# Altium schematic sheet Sheet1.SchDoc (part 3 of 3)
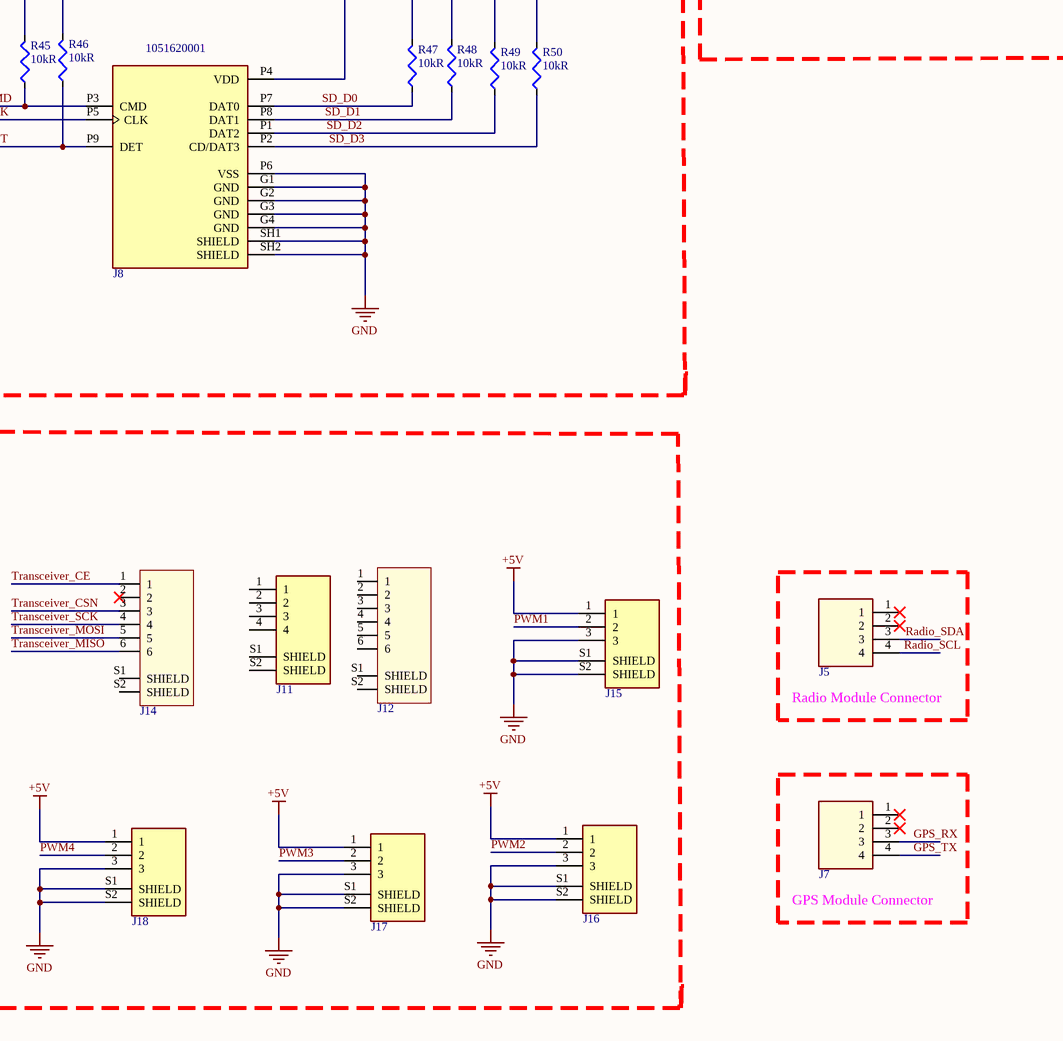
[diagram p5: Sheet1.SchDoc, bottom right]

## Library data of the parts (continued)
R14 R15 = ERJ-2RKF4701X: Res Thick Film 0402 4.7K Ohm 1% 1/10W ±100ppm/°C Molded SMD Punched Carrier T/R; Manufacturer: Panasonic; Power Rating: 100mW; Voltage Rating: 50V; Supplier: Rs; Supplier Part Number: 7325517; Manufacturer Part Number: ERJ-2RKF4701X; RoHS: Yes; Category: Chip SMD Resistors; Stock: 290000; Pricing: 10000=0.00400 (GBP); Mounting Technology: Surface Mount; Case/Package: 0402; Pins: 2; Contact Plating: Tin; Case Code (Metric): 1005; Case Code (Imperial): 0402; Weight: 0.000388oz; Min Operating Temperature: -55°C; Max Operating Temperature: 155°C; Tolerance: 1%; Resistor Type: Thick Film; Temperature Coefficient: 100ppm/°C; Packaging: Cut Tape; Package Quantity: 10000; Number of Terminations: 2; Termination: SMD/SMT; Max Power Dissipation: 100mW; Voltage Rating (DC): 50V; Features: Automotive AEC-Q200; Series: ERJ-2Rx; Technology: THICK FILM; Length: 1mm; Width: 0.5mm; Height: 0.35mm; Depth: 0.5mm; Radiation Hardening: No; Lead Free: Lead Free; Reach SVHC Compliant: Yes; Military Standard: Not; RoHS Compliant: Yes; ComponentLink1URL: https://datasheet.ciiva.com/11821/0900766b80f80784-11821329.pdf?src-supplier=Rs; ComponentLink1Description: https://datasheet.ciiva.com/11821/0900766b80f80784-11821329.pdf?src-supplier=Rs; ComponentLink2URL: https://datasheet.ciiva.com/7830/aoa0000ce2-7830727.pdf?src-supplier=Element14; ComponentLink2Description: https://datasheet.ciiva.com/7830/aoa0000ce2-7830727.pdf?src-supplier=Element14; ComponentLink3URL: https://datasheet.ciiva.com/22781/1678782-22781576.pdf?src-supplier=Farnell; ComponentLink3Description: https://datasheet.ciiva.com/22781/1678782-22781576.pdf?src-supplier=Farnell; ComponentLink4URL: https://datasheet.ciiva.com/22667/1678782-22667886.pdf?src-supplier=Element14; ComponentLink4Description: https://datasheet.ciiva.com/22667/1678782-22667886.pdf?src-supplier=Element14; ComponentLink5URL: https://datasheet.ciiva.com/22723/1678782-22723903.pdf?src-supplier=Element14; ComponentLink5Description: https://datasheet.ciiva.com/22723/1678782-22723903.pdf?src-supplier=Element14; ComponentLink6URL: https://datasheet.ciiva.com/24025/aoa0000ce2-24025663.pdf?src-supplier=Mouser; ComponentLink6Description: https://datasheet.ciiva.com/24025/aoa0000ce2-24025663.pdf?src-supplier=Mouser; ComponentLink7URL: https://datasheet.ciiva.com/16763/70260748-16763151.pdf?src-supplier=Allied+Electronics; ComponentLink7Description: https://datasheet.ciiva.com/16763/70260748-16763151.pdf?src-supplier=Allied+Electronics; ComponentLink8URL: https://datasheet.ciiva.com/9195/aoa0000ce2-9195737.pdf?src-supplier=Avnet; ComponentLink8Description: https://datasheet.ciiva.com/9195/aoa0000ce2-9195737.pdf?src-supplier=Avnet; ComponentLink9URL: https://datasheet.ciiva.com/30053/aoa0000ce2-30053990.pdf?src-supplier=Onlinecomponents.com; ComponentLink9Description: https://datasheet.ciiva.com/30053/aoa0000ce2-30053990.pdf?src-supplier=Onlinecomponents.com
R18 R19 = ERJ-2GE0R00X: SMD Chip Resistor, Jumper, 0 ohm, 100 mW, 0402 [1005 Metric], Thick Film, General Purpose; Manufacturer: Panasonic; Power Rating: 100mW; Voltage Rating: 50V; Tolerance: 5%; Temperature Coefficient: 600ppm/°C; Supplier: Digi-Key; Supplier Part Number: P0.0JCT-ND; Manufacturer Part Number: ERJ-2GE0R00X; RoHS: Yes; Category: Chip SMD Resistors; Stock: 12419974; Pricing: 1=0.10000, 10=0.02700, 25=0.02000, 50=0.01500, 100=0.01110, 250=0.00848, 500=0.00680, 1000=0.00500, 5000=0.00359 (USD); Mounting Technology: Surface Mount; Case/Package: 0402; Contact Plating: Tin; Case Code (Metric): 1005; Case Code (Imperial): 0402; Min Operating Temperature: -55°C; Max Operating Temperature: 155°C; Resistor Type: Thick Film; Packaging: Cut Tape; Package Quantity: 10000; Number of Terminations: 2; Termination: SMD/SMT; Max Power Dissipation: 100mW; Voltage Rating (DC): 50V; Features: Automotive AEC-Q200; Series: ERJ; Construction: Rectangular; Technology: THICK FILM; Length: 1mm; Width: 0.5mm; Height: 0.35mm; Depth: 0.5mm; Ratings: AEC-Q200; Radiation Hardening: No; Reach SVHC Compliant: Yes; Military Standard: Not; Lead Free: Lead Free; RoHS Compliant: Yes; ComponentLink1URL: https://datasheet.ciiva.com/11821/0900766b80f806dd-11821176.pdf?src-supplier=Rs; ComponentLink1Description: https://datasheet.ciiva.com/11821/0900766b80f806dd-11821176.pdf?src-supplier=Rs; ComponentLink2URL: https://datasheet.ciiva.com/43460/1678796-43460347.pdf?src-supplier=Farnell; ComponentLink2Description: https://datasheet.ciiva.com/43460/1678796-43460347.pdf?src-supplier=Farnell; ComponentLink3URL: https://datasheet.ciiva.com/46389/1678796-46389518.pdf?src-supplier=Element14; ComponentLink3Description: https://datasheet.ciiva.com/46389/1678796-46389518.pdf?src-supplier=Element14; ComponentLink4URL: https://datasheet.ciiva.com/5959/1678796-5959692.pdf?src-supplier=Farnell; ComponentLink4Description: https://datasheet.ciiva.com/5959/1678796-5959692.pdf?src-supplier=Farnell; ComponentLink5URL: https://datasheet.ciiva.com/28695/1678796-28695758.pdf?src-supplier=Element14; ComponentLink5Description: https://datasheet.ciiva.com/28695/1678796-28695758.pdf?src-supplier=Element14; ComponentLink6URL: https://datasheet.ciiva.com/16783/70260739-16783734.pdf?src-supplier=Allied+Electronics; ComponentLink6Description: https://datasheet.ciiva.com/16783/70260739-16783734.pdf?src-supplier=Allied+Electronics; ComponentLink7URL: https://datasheet.ciiva.com/16778/70260739-16778335.pdf?src-supplier=Allied+Electronics; ComponentLink7Description: https://datasheet.ciiva.com/16778/70260739-16778335.pdf?src-supplier=Allied+Electronics; ComponentLink8URL: https://datasheet.ciiva.com/48531/aoa0000ce1-48531077.pdf?src-supplier=Avnet; ComponentLink8Description: https://datasheet.ciiva.com/48531/aoa0000ce1-48531077.pdf?src-supplier=Avnet; ComponentLink9URL: https://datasheet.ciiva.com/30097/4aoa0000ce1-30097116.pdf?src-supplier=Onlinecomponents.com; ComponentLink9Description: https://datasheet.ciiva.com/30097/4aoa0000ce1-30097116.pdf?src-supplier=Onlinecomponents.com
R20-R22 = ERA2AEB5112X: 51.1 kOhms ±0.1% 0.063W, 1/16W Chip Resistor 0402 (1005 Metric) Automotive AEC-Q200 Thin Film; Manufacturer Part Number: ERA2AEB5112X
R23 R24 R28 = RT0402BRD07220KL: High Precision-High Stability Chip Resistor Thin Film 0402 220kOhm 0.1% Paper T/R; Manufacturer: Yageo; Supplier: Arrow Electronics; Supplier Part Number: RT0402BRD07220KL; Manufacturer Part Number: RT0402BRD07220KL; RoHS: Yes; Category: Chip SMD Resistors; Stock: 310000; Pricing: 10000=0.047, 20000=0.0452, 30000=0.0442, 50000=0.0425, 100000=0.0416 (USD); Case/Package: 0402
R25-R27 = ERJ-2RKF3401X: Res Thick Film 0402 3.4K Ohm 1% 1/10W ±100ppm/°C Molded SMD Punched Carrier T/R; Manufacturer: Panasonic; Voltage Rating (DC): 50V; Supplier: Mouser; Supplier Part Number: 667-ERJ-2RKF3401X; Manufacturer Part Number: ERJ-2RKF3401X; RoHS: Yes; Category: Chip SMD Resistors; Stock: 133092; Pricing: 1=0.1, 10=0.023, 50=0.023, 100=0.013, 1000=0.008, 10000=0.004 (USD); Lead Free: 5698LeadFree; ComponentLink1URL: https://datasheet.ciiva.com/6201/426256-6201358.pdf?src-supplier=Farnell; ComponentLink1Description: https://datasheet.ciiva.com/6201/426256-6201358.pdf?src-supplier=Farnell; ComponentLink2URL: https://datasheet.ciiva.com/9196/aoa0000ce2-9196415.pdf?src-supplier=Avnet; ComponentLink2Description: https://datasheet.ciiva.com/9196/aoa0000ce2-9196415.pdf?src-supplier=Avnet; ComponentLink3URL: https://datasheet.ciiva.com/24160/aoa0000ce2-24160133.pdf?src-supplier=Mouser; ComponentLink3Description: https://datasheet.ciiva.com/24160/aoa0000ce2-24160133.pdf?src-supplier=Mouser; ComponentLink4URL: https://datasheet.ciiva.com/30115/aoa0000ce2-30115213.pdf?src-supplier=Onlinecomponents.com; ComponentLink4Description: https://datasheet.ciiva.com/30115/aoa0000ce2-30115213.pdf?src-supplier=Onlinecomponents.com; ComponentLink5URL: https://datasheet.ciiva.com/16771/70260748-16771656.pdf?src-supplier=Allied+Electronics; ComponentLink5Description: https://datasheet.ciiva.com/16771/70260748-16771656.pdf?src-supplier=Allied+Electronics; ComponentLink6URL: https://datasheet.ciiva.com/16774/70260748-16774598.pdf?src-supplier=Allied+Electronics; ComponentLink6Description: https://datasheet.ciiva.com/16774/70260748-16774598.pdf?src-supplier=Allied+Electronics; ComponentLink7URL: https://datasheet.ciiva.com/46389/426256-46389135.pdf?src-supplier=Element14; ComponentLink7Description: https://datasheet.ciiva.com/46389/426256-46389135.pdf?src-supplier=Element14; Case/Package: 0402
R29-R31 = RT0402BRD07140KL: SMD Chip Resistor, 140 kOhm, ± 0.1%, 63 mW, 0402 [1005 Metric], Thin Film, High Precision High Stability; Manufacturer: Yageo; Temperature Coefficient: 25ppm/°C; Supplier: Farnell; Supplier Part Number: 4312055; Manufacturer Part Number: RT0402BRD07140KL; RoHS: Yes; Category: Chip SMD Resistors; Stock: 9900; Pricing: 10=0.121, 100=0.105, 500=0.066, 2500=0.057, 5000=0.048, 10000=0.047, 50000=0.0461, 100000=0.0451 (EUR); Case/Package: 0402; Packaging: 10Packaging; ComponentLink1URL: https://datasheet.octopart.com/RT0402BRD07140KL-Yageo-datasheet-166250672.pdf?src-supplier=Future+Electronics; ComponentLink1Description: https://datasheet.octopart.com/RT0402BRD07140KL-Yageo-datasheet-166250672.pdf?src-supplier=Future+Electronics; ComponentLink2URL: https://datasheet.octopart.com/RT0402BRD07140KL-Yageo-datasheet-164439670.pdf?src-supplier=Newark; ComponentLink2Description: https://datasheet.octopart.com/RT0402BRD07140KL-Yageo-datasheet-164439670.pdf?src-supplier=Newark
R32 R33 R36 = ERA-2APB433X: 0402 Thin Film Chip Resistor / 0402 SMD Resistor 0.1% 15PPM 43 Kohm; Manufacturer: Panasonic; Max Power Dissipation: 63mW; Temperature Coefficient: 15ppm/°C; Supplier: Mouser; Supplier Part Number: 667-ERA-2APB433X; Manufacturer Part Number: ERA-2APB433X; RoHS: Yes; Category: Chip SMD Resistors; Stock: 8335; Pricing: 1=0.73, 10=0.471, 50=0.471, 100=0.41, 1000=0.24, 10000=0.218 (USD); Case/Package: 0402; Case Code (Metric): 1005; Case Code (Imperial): 0402; Min Operating Temperature: -55°C; Max Operating Temperature: 155°C; Packaging: Cut Tape; Number of Terminations: 2; Features: Automotive AEC-Q200; Series: ERA-2A; Length: 0.039inch; Width: 0.02inch; Height: 0.016inch; Lead Free: Lead Free; ComponentLink1URL: https://media.digikey.com/pdf/Data%20Sheets/Panasonic%20Resistors%20Thermistors%20PDFs/ERA_Series_LE.pdf?src-supplier=Digi-Key; ComponentLink1Description: https://media.digikey.com/pdf/Data%20Sheets/Panasonic%20Resistors%20Thermistors%20PDFs/ERA_Series_LE.pdf?src-supplier=Digi-Key
R34 R35 R37 = ERA-2AEB104X: Res Thin Film 0402 100K Ohm 0.1% 0.063W ±25ppm/°C Molded SMD Punched Carrier T/R; Manufacturer: Panasonic; Voltage Rating (DC): 25V; Supplier: Mouser; Supplier Part Number: 667-ERA-2AEB104X; Manufacturer Part Number: ERA-2AEB104X; RoHS: Yes; Category: Chip SMD Resistors; Stock: 96467; Pricing: 1=0.17, 10=0.102, 50=0.102, 100=0.091, 1000=0.061, 10000=0.051 (USD); Lead Free: 5697LeadFree; ComponentLink1URL: https://datasheet.ciiva.com/11812/0900766b80beefcc-11812257.pdf?src-supplier=Rs; ComponentLink1Description: https://datasheet.ciiva.com/11812/0900766b80beefcc-11812257.pdf?src-supplier=Rs; ComponentLink2URL: https://datasheet.ciiva.com/16787/70068849-16787783.pdf?src-supplier=Allied+Electronics; ComponentLink2Description: https://datasheet.ciiva.com/16787/70068849-16787783.pdf?src-supplier=Allied+Electronics; ComponentLink3URL: https://datasheet.ciiva.com/46398/328837-46398997.pdf?src-supplier=Element14; ComponentLink3Description: https://datasheet.ciiva.com/46398/328837-46398997.pdf?src-supplier=Element14; ComponentLink4URL: https://datasheet.ciiva.com/16396/aoa0000ce26-16396826.pdf?src-supplier=Future+Electronics; ComponentLink4Description: https://datasheet.ciiva.com/16396/aoa0000ce26-16396826.pdf?src-supplier=Future+Electronics; ComponentLink5URL: https://datasheet.ciiva.com/9186/aoa0000ce26-9186748.pdf?src-supplier=Avnet; ComponentLink5Description: https://datasheet.ciiva.com/9186/aoa0000ce26-9186748.pdf?src-supplier=Avnet; ComponentLink6URL: https://datasheet.ciiva.com/9116/aoa0000ce26-9116650.pdf?src-supplier=Avnet; ComponentLink6Description: https://datasheet.ciiva.com/9116/aoa0000ce26-9116650.pdf?src-supplier=Avnet; ComponentLink7URL: https://datasheet.ciiva.com/5838/328837-5838014.pdf?src-supplier=Farnell; ComponentLink7Description: https://datasheet.ciiva.com/5838/328837-5838014.pdf?src-supplier=Farnell; Case/Package: 0402
R38 = RC0402FR-0778K7L: Res Thick Film 0402 78.7K Ohm 1% 1/16W ±100ppm/°C Molded SMD Paper T/R; Manufacturer: Yageo; Power Rating: 62.5mW; Voltage Rating: 50V; Max Power Dissipation: 63mW; Supplier: Future Electronics; Supplier Part Number: 7141302; Manufacturer Part Number: RC0402FR-0778K7L; RoHS: Yes; Category: Chip SMD Resistors; Stock: 430000; Pricing: 10000=0.0015, 50000=0.0015, 250000=0.0014, 500000=0.0013, 1500000=0.0012 (USD); Case/Package: 0402; Contact Plating: Tin,Matte; Case Code (Metric): 1005; Case Code (Imperial): 0402; Weight: 2.3E-05oz; Min Operating Temperature: -55°C; Max Operating Temperature: 155°C; Tolerance: 1%; Temperature Coefficient: 100ppm/°C; Package Quantity: 1; Packaging: Tape and Reel; Number of Terminations: 2; Termination: SMD/SMT; Features: Moisture Resistant; Series: RC; Construction: Rectangular; Voltage Rating (DC): 50V; Length: 1mm; Width: 0.02inch; Height: 0.016inch; Depth: 0.5mm; Military Standard: Not; RoHS Compliant: Yes; Lead Free: 5697LeadFree; ComponentLink1URL: https://datasheet.ciiva.com/2491/pyu-r-int-thick-7-2491262.pdf?src-supplier=Digikey; ComponentLink1Description: https://datasheet.ciiva.com/2491/pyu-r-int-thick-7-2491262.pdf?src-supplier=Digikey; ComponentLink2URL: https://datasheet.ciiva.com/2491/pyu-r-int-thick-7-2491263.pdf?src-supplier=Digikey; ComponentLink2Description: https://datasheet.ciiva.com/2491/pyu-r-int-thick-7-2491263.pdf?src-supplier=Digikey; ComponentLink3URL: https://datasheet.ciiva.com/2491/pyu-r-int-thick-7-2491261.pdf?src-supplier=Digikey; ComponentLink3Description: https://datasheet.ciiva.com/2491/pyu-r-int-thick-7-2491261.pdf?src-supplier=Digikey; ComponentLink4URL: https://datasheet.ciiva.com/5596/pyu-rc0402-51-rohs-l-6-r-5596046.pdf?src-supplier=Mouser; ComponentLink4Description: https://datasheet.ciiva.com/5596/pyu-rc0402-51-rohs-l-6-r-5596046.pdf?src-supplier=Mouser; ComponentLink5URL: https://datasheet.ciiva.com/8888/pyu-rc0402-51-rohs-l-6-8888223.pdf?src-supplier=Avnet; ComponentLink5Description: https://datasheet.ciiva.com/8888/pyu-rc0402-51-rohs-l-6-8888223.pdf?src-supplier=Avnet; ComponentLink6URL: https://datasheet.ciiva.com/17423/pyu-rc0402-51-rohs-l-6-r-17423799.pdf?src-supplier=Future+Electronics; ComponentLink6Description: https://datasheet.ciiva.com/17423/pyu-rc0402-51-rohs-l-6-r-17423799.pdf?src-supplier=Future+Electronics
R39 = TNPW040232K0BEED: SMD Chip Resistor, 32 kOhm, ± 0.1%, 100 mW, 0402 [1005 Metric], Thin Film, High Stability; Manufacturer: Vishay Dale; Supplier: Mouser; Supplier Part Number: 71-TNPW040232K0BEED; Manufacturer Part Number: TNPW040232K0BEED; RoHS: Yes; Category: Chip SMD Resistors; Stock: 21931; Pricing: 1=0.35, 10=0.243, 50=0.193, 100=0.171, 1000=0.114, 10000=0.1 (USD); ComponentLink1URL: https://datasheet.ciiva.com/9017/tnpw-e3-9017983.pdf?src-supplier=Avnet; ComponentLink1Description: https://datasheet.ciiva.com/9017/tnpw-e3-9017983.pdf?src-supplier=Avnet; Case/Package: 0402
R40 = ERA3AEB1912V: 100mW Thin Film Resistor 75V ±0.1% ±25ppm/℃ 19.1kΩ 0603 Chip Resistor - Surface Mount ROHS; Manufacturer Part Number: ERA3AEB1912V
R42 = RMCF0201ZT0R00: Res Thick Film 0201 0 Ohm Jumper Molded SMD Paper T/R; Manufacturer: Stackpole Electronics; Voltage Rating: 25V; Supplier: Mouser; Supplier Part Number: 708-RMCF0201ZT0R00; Manufacturer Part Number: RMCF0201ZT0R00; RoHS: Yes; Category: Chip SMD Resistors; Stock: 435831; Pricing: 1=0.1, 10=0.01, 50=0.01, 100=0.006, 1000=0.004, 10000=0.002 (USD); Lead Free: 5697LeadFree; ComponentLink1URL: http://www.seielect.com/Catalog/SEI-RMC.pdf?src-supplier=Future+Electronics; ComponentLink1Description: http://www.seielect.com/Catalog/SEI-RMC.pdf?src-supplier=Future+Electronics; ComponentLink2URL: https://datasheet.octopart.com/RMCF0201ZT0R00-Stackpole-Electronics-datasheet-11547379.pdf?src-supplier=Future+Electronics; ComponentLink2Description: https://datasheet.octopart.com/RMCF0201ZT0R00-Stackpole-Electronics-datasheet-11547379.pdf?src-supplier=Future+Electronics; ComponentLink3URL: https://www.seielect.com/catalog/SEI-Packaging.pdf?src-supplier=Digikey; ComponentLink3Description: https://www.seielect.com/catalog/SEI-Packaging.pdf?src-supplier=Digikey; ComponentLink4URL: https://www.seielect.com/catalog/SEI-RMCF_RMCP.pdf?src-supplier=Avnet; ComponentLink4Description: https://www.seielect.com/catalog/SEI-RMCF_RMCP.pdf?src-supplier=Avnet; ComponentLink5URL: https://datasheet.octopart.com/RMCF0201ZT0R00-Stackpole-Electronics-datasheet-155966809.pdf?src-supplier=Master+Electronics; ComponentLink5Description: https://datasheet.octopart.com/RMCF0201ZT0R00-Stackpole-Electronics-datasheet-155966809.pdf?src-supplier=Master+Electronics; Case/Package: 0201
R51 = ERJ-2RKF10R0X: Res Thick Film 0402 10 Ohm 1% 1/10W ±100ppm/°C Molded SMD Punched Carrier T/R; Manufacturer: Panasonic; Power Rating: 100mW; Voltage Rating: 50V; Supplier: Mouser; Supplier Part Number: 667-ERJ-2RKF10R0X; Manufacturer Part Number: ERJ-2RKF10R0X; RoHS: Yes; Category: Chip SMD Resistors; Stock: 1740684; Pricing: 1=0.1, 10=0.017, 50=0.017, 100=0.008, 1000=0.006, 10000=0.004 (USD); Case Code (Imperial): 0402; Case Code (Metric): 1005; Weight: 0.000388oz; Min Operating Temperature: -55°C; Max Operating Temperature: 155°C; Tolerance: 1%; Packaging: Cut Tape; Package Quantity: 10000; Termination: SMD/SMT; Temperature Coefficient: 100ppm/°C; Voltage Rating (DC): 50V; Series: ERJ-2Rx; Technology: THICK FILM; Length: 1mm; Width: 0.5mm; Height: 0.35mm; Lead Free: Lead Free; RoHS Compliant: Yes; ComponentLink1URL: https://datasheet.ciiva.com/11821/0900766b80f80784-11821168.pdf?src-supplier=Rs; ComponentLink1Description: https://datasheet.ciiva.com/11821/0900766b80f80784-11821168.pdf?src-supplier=Rs; ComponentLink2URL: https://datasheet.ciiva.com/6082/aoa0000ce2-6082046.pdf?src-supplier=Farnell; ComponentLink2Description: https://datasheet.ciiva.com/6082/aoa0000ce2-6082046.pdf?src-supplier=Farnell; ComponentLink3URL: https://datasheet.ciiva.com/43467/1678782-43467127.pdf?src-supplier=Farnell; ComponentLink3Description: https://datasheet.ciiva.com/43467/1678782-43467127.pdf?src-supplier=Farnell; ComponentLink4URL: https://datasheet.ciiva.com/7802/aoa0000ce2-7802405.pdf?src-supplier=Element14; ComponentLink4Description: https://datasheet.ciiva.com/7802/aoa0000ce2-7802405.pdf?src-supplier=Element14; ComponentLink5URL: https://datasheet.ciiva.com/27055/1987054-27055644.pdf?src-supplier=Jameco; ComponentLink5Description: https://datasheet.ciiva.com/27055/1987054-27055644.pdf?src-supplier=Jameco; ComponentLink6URL: https://datasheet.ciiva.com/22668/1678782-22668302.pdf?src-supplier=Element14; ComponentLink6Description: https://datasheet.ciiva.com/22668/1678782-22668302.pdf?src-supplier=Element14; ComponentLink7URL: https://datasheet.ciiva.com/24071/aoa0000ce2-24071514.pdf?src-supplier=Mouser; ComponentLink7Description: https://datasheet.ciiva.com/24071/aoa0000ce2-24071514.pdf?src-supplier=Mouser; ComponentLink8URL: https://datasheet.ciiva.com/16773/70260748-16773366.pdf?src-supplier=Allied+Electronics; ComponentLink8Description: https://datasheet.ciiva.com/16773/70260748-16773366.pdf?src-supplier=Allied+Electronics; ComponentLink9URL: https://datasheet.ciiva.com/9194/aoa0000ce2-9194120.pdf?src-supplier=Avnet; ComponentLink9Description: https://datasheet.ciiva.com/9194/aoa0000ce2-9194120.pdf?src-supplier=Avnet; ComponentLink10URL: https://datasheet.ciiva.com/30218/aoa0000ce2-30218536.pdf?src-supplier=Onlinecomponents.com; ComponentLink10Description: https://datasheet.ciiva.com/30218/aoa0000ce2-30218536.pdf?src-supplier=Onlinecomponents.com; Case/Package: 0402
SW1 = 1825232-1: Switch Slide ON None ON SPDT Side Slide 0.2A 30VDC 10000Cycle PC Pins Bracket Mount/Through Hole; Manufacturer: TE Connectivity AMP; Mechanical Life: 10000Cycles; Actuator Material: Nylon; Voltage Rating (DC): 30V; Current Rating: 200mA; Operating Force: 200gf; Contact Style: Non-Shorting; Switch Travel: 2mm; Number of Positions: 2; PCB Mount Retention: With; Switch Function: On-On; Actuator Type: Standard; Actuator Length: 0.118inch; Tail Length: 0.094inch; Supplier: Avnet; Supplier Part Number: 97X7939; Manufacturer Part Number: 1825232-1; RoHS: Yes; Category: Slide Switches; Stock: 7369; Pricing: 1=0.45000, 10=0.43100, 25=0.40900, 100=0.37200, 500=0.32000, 1000=0.26700 (USD); Mounting Technology: Through Hole; Contact Material: Copper Alloy; Contact Plating: Silver; Min Operating Temperature: -20°C; Max Operating Temperature: 70°C; Throw Configuration: SPDT; Package Quantity: 19200; Packaging: Tray; Max Voltage Rating (DC): 30V; Termination: PC Pin; Electrical Life: 10000Cycles; Orientation: Right Angle; Contact Current Rating: 200mA; Type: Switch; Length: 0.3563inch; Width: 4.3mm; ELV: Compliant; Flammability Rating: UL94 HB; RoHS Compliant: Yes; ComponentLink1URL: https://datasheet.ciiva.com/15085/eng-cd-1825232-b2-15085854.pdf?src-supplier=Digi-Key; ComponentLink1Description: https://datasheet.ciiva.com/15085/eng-cd-1825232-b2-15085854.pdf?src-supplier=Digi-Key
U1-U3 = TPS54335ADDA: 4.5V to 28V Input, 3A, Synchronous, Step-Down Converter with Eco-mode; Manufacturer Part Number: TPS54335ADDA; ComponentLink1URL: https://datasheet.ciiva.com/48512/tps54361-q1-48512600.pdf?src-supplier=Avnet; ComponentLink1Description: https://datasheet.ciiva.com/48512/tps54361-q1-48512600.pdf?src-supplier=Avnet
U4 = ICM-20948: Accelerometer, Gyroscope, Magnetometer, 9 Axis Sensor I2C, SPI Output; Manufacturer Part Number: ICM-20948
U6 = IIS2MDCTR: Magnetoresistive Sensor X, Y, Z Axis 12-LGA (2x2); Manufacturer Part Number: IIS2MDCTR
U7 = nRF24L01: IC RF TxRx Only General ISM > 1GHz - 2.4GHz 20-VFQFN Exposed Pad; Manufacturer Part Number: nRF24L01
U8 = BMP180: Pressure Sensor 4.35PSI ~ 15.95PSI (30kPa ~ 110kPa) Absolute - 16 ~ 19 b 7-VLGA; Manufacturer Part Number: BMP180
U9 = W25Q256JVEIQ: FLASH - NOR Memory IC 256Mb (32M x 8) SPI - Quad I/O 133 MHz 8-WSON (8x6); Manufacturer Part Number: W25Q256JVEIQ
U10 = NEO-M9N-00B: series RF Receiver BeiDou, Galileo, GLONASS, GNSS, GPS - -167dBm - - Module; Manufacturer Part Number: NEO-M9N-00B
U11 = RA-01H: MÃ´-Ä‘un thu phÃ¡t LoRaâ„¢ ISM < 1GHz chung KhÃ´ng bao gá»“m Äƒng-ten 803 MHz ~ 930 MHz GiÃ¡ treo bá» máº·t
U14 = STM32F750V8T6: ARMÂ® CortexÂ®-M7 STM32F7 Microcontroller IC 32-Bit Single-Core 216MHz 64KB (64K x 8) FLASH 100-LQFP (14x14); Manufacturer Part Number: STM32F750V8T6
Y1 Y2 = ECS-160-20-46X: 16 MHz Â±30ppm Crystal 20pF 50 Ohms HC-46/X; Manufacturer Part Number: ECS-160-20-46X
Y4 = ECS-320-8-37CKM: 32 MHz Â±10ppm Crystal 8pF 60 Ohms 4-SMD, No Lead; Manufacturer Part Number: ECS-320-8-37CKM